# Altium schematic sheet RCReceiver.SchDoc
size A4
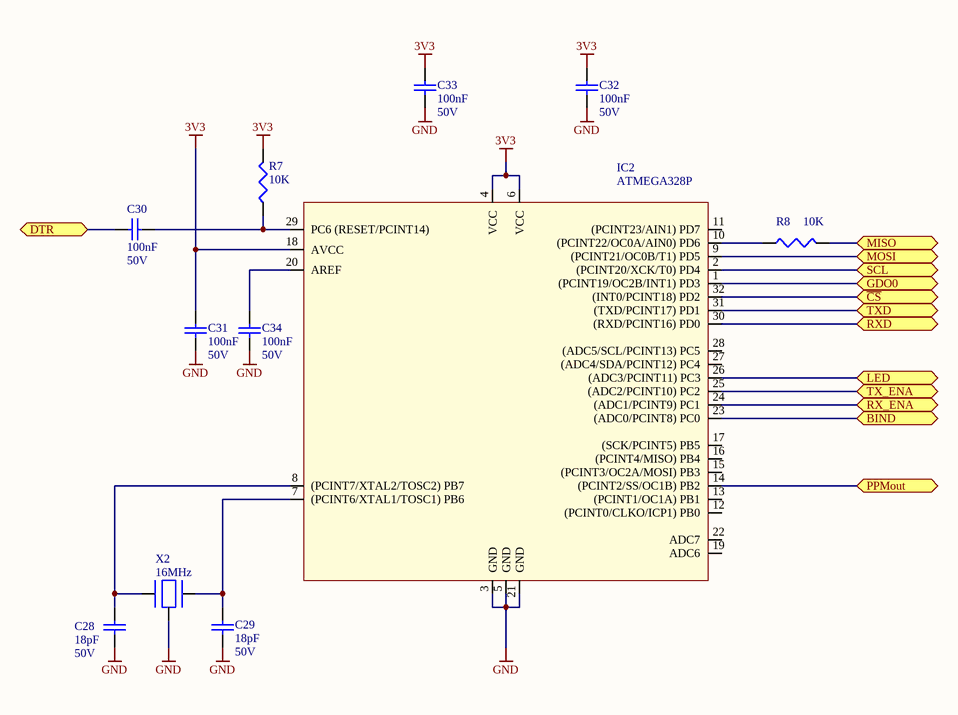
[diagram p0: RCReceiver.SchDoc]

## Parts
C28  18pF  Voltage Rating: 50V  [C0603]
C29  18pF  Voltage Rating: 50V  [C0603]
C30  100nF  Voltage Rating: 50V  [C0603]
C31  100nF  Voltage Rating: 50V  [C0603]
C32  100nF  Voltage Rating: 50V  [C0603]
C33  100nF  Voltage Rating: 50V  [C0603]
C34  100nF  Voltage Rating: 50V  [C0603]
IC2  ATMEGA328P  [LFCSP32]
R7  10K  [0603]
R8  10K  [0603]
X2  16MHz  [7M]

## Ports
BIND, DTR, GDO0, LED, MISO, MOSI, PPMout, RX_ENA, RXD, SCL, TX_ENA, TXD, ~{CS}

## Nets
3V3: C31.2 C32.2 C33.2 IC2.4(VCC) IC2.6(VCC) IC2.18(AVCC) R7.2
GND: C28.1 C29.1 C31.1 C32.1 C33.1 C34.1 IC2.3(GND) IC2.5(GND) IC2.21(GND) X2.0
BIND: IC2.23((ADC0/PCINT8)_PC0) ; port BIND
~{CS}: IC2.32((INT0/PCINT18)_PD2) ; port ~{CS}
DTR: C30.1 ; port DTR
GDO0: IC2.1((PCINT19/OC2B/INT1)_PD3) ; port GDO0
LED: IC2.26((ADC3/PCINT11)_PC3) ; port LED
MISO: R8.2 ; port MISO
MOSI: IC2.9((PCINT21/OC0B/T1)_PD5) ; port MOSI
PPMout: IC2.14((PCINT2/SS/OC1B)_PB2) ; port PPMout
RX_ENA: IC2.24((ADC1/PCINT9)_PC1) ; port RX_ENA
RXD: IC2.30((RXD/PCINT16)_PD0) ; port RXD
SCL: IC2.2((PCINT20/XCK/T0)_PD4) ; port SCL
TX_ENA: IC2.25((ADC2/PCINT10)_PC2) ; port TX_ENA
TXD: IC2.31((TXD/PCINT17)_PD1) ; port TXD
NetC28_2: C28.2 IC2.8((PCINT7/XTAL2/TOSC2)_PB7) X2.1
NetC29_2: C29.2 IC2.7((PCINT6/XTAL1/TOSC1)_PB6) X2.2
NetC30_2: C30.2 IC2.29(PC6_(RESET/PCINT14)) R7.1
NetC34_2: C34.2 IC2.20(AREF)
NetIC2_10: IC2.10((PCINT22/OC0A/AIN0)_PD6) R8.1

Not connected (* = marked no-connect by the designer): IC2 11((PCINT23/AIN1)_PD7) 12((PCINT0/CLKO/ICP1)_PB0) 13((PCINT1/OC1A)_PB1) 15((PCINT3/OC2A/MOSI)_PB3) 16((PCINT4/MISO)_PB4) 17((SCK/PCINT5)_PB5) 19(ADC6) 22(ADC7) 27((ADC4/SDA/PCINT12)_PC4) 28((ADC5/SCL/PCINT13)_PC5)

## Library data of the parts
C28 C29 = 18pF/0603/CER/50V: Capacitor, 18pF, 50V, C0G / NP0; Capacitance Tolerance: ± 5%; Capacitor Case Style: 0603; Brand Number: MC0603N180J500CT; Brand: MULTICOMP; Dielectric Characteristic: C0G / NP0; Capacitance: 18pF; Temperature Range: -55°C to +125°C; Price: 0,009; Order Code Supplier: 1759056; Supplier: Farnell
C30-C34 = 100nF/0603/CER/50V: Capacitor, 100nF, 50V, X7R; Capacitance Tolerance: ± 10%; Capacitor Case Style: 0603; Brand Number: MCCA000255; Brand: MULTICOMP; Dielectric Characteristic: X7R; Capacitance: 100nF; Temperature Range: -55°C to +125°C; Price: 0,008; Order Code Supplier: 1759122RL; Supplier: Farnell
IC2 = ATMEGA328P: 8-Bit microcontroller ATMEL
R7 R8 = 10K/0603/0063W/50V: Resistor, 10K, 1%, 0.063W, 50V, 100PPM, 0603; Brand: VISHAY DRALORIC; Brand Number: CRCW060310K0FKEA; Case Style: 0603; Order Code Supplier: 2122493; Power Rating: 0.063W; Price: 0,038; Resistance: 10K; Supplier: Farnell; Temperature Coefficient: ± 100PPM; Temperature Range: -55°C to +125°C; Voltage Rating: 50V
X2 = 7M-16.000MAAJ-T: CRYSTAL, 16MHz,18PF CL, 3.2X2.5MM SMT; Brand: TXC; Order Code Supplier: 1842060; Price: 1,45; Supplier: Farnell; Brand Number: 7M-16.000MAAJ-T